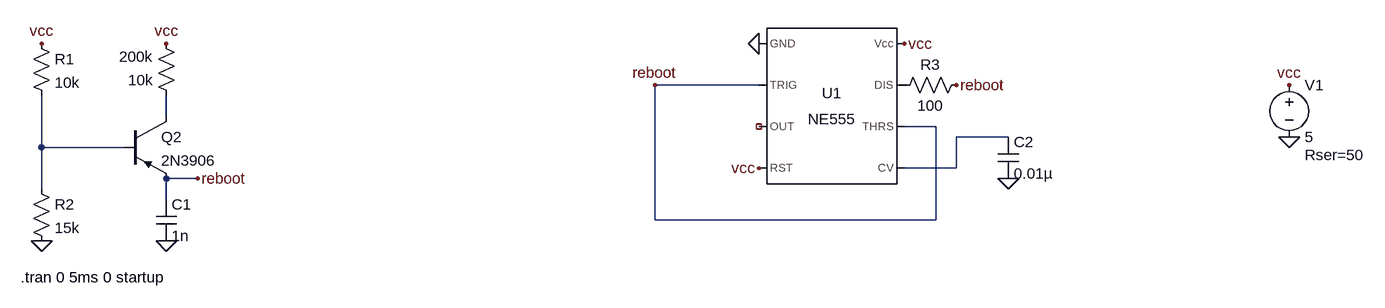
[diagram p0: schematic es la que va.asc]
es la que va.asc, the LTspice schematic file:
Version 4
SHEET 1 2016 680
WIRE 1072 0 912 0
WIRE 160 48 160 16
WIRE 1344 64 1296 64
WIRE 1456 80 1376 80
WIRE -32 96 -32 16
WIRE 96 96 -32 96
WIRE 1376 128 1376 80
WIRE 1376 128 1296 128
WIRE 208 144 160 144
WIRE -32 160 -32 96
WIRE 160 176 160 144
WIRE 912 208 912 0
WIRE 1344 208 1344 64
WIRE 1344 208 912 208
FLAG -32 -64 vcc
FLAG 160 -64 vcc
FLAG -32 240 0
FLAG 160 240 0
FLAG 1072 -64 0
FLAG 1296 -64 vcc
FLAG 208 144 reboot
FLAG 1072 128 vcc
FLAG 1456 144 0
FLAG 1888 80 0
FLAG 1888 0 vcc
FLAG 912 0 reboot
FLAG 1376 0 reboot
SYMBOL res -48 -80 R0
SYMATTR InstName R1
SYMATTR Value 10k
SYMBOL res -48 144 R0
SYMATTR InstName R2
SYMATTR Value 15k
SYMBOL res 176 32 R180
WINDOW 0 36 76 Left 2
WINDOW 3 36 40 Left 2
SYMATTR InstName 200k
SYMATTR Value 10k
SYMBOL cap 144 176 R0
SYMATTR InstName C1
SYMATTR Value 1n
SYMBOL pnp 96 48 R0
SYMATTR InstName Q2
SYMATTR Value 2N3906
SYMBOL Misc\\NE555 1184 32 R0
SYMATTR InstName U1
SYMBOL cap 1440 80 R0
SYMATTR InstName C2
SYMATTR Value 0.01µ
SYMBOL voltage 1888 -16 R0
WINDOW 123 0 0 Left 0
WINDOW 39 24 124 Left 2
SYMATTR SpiceLine Rser=50
SYMATTR InstName V1
SYMATTR Value 5
SYMBOL res 1392 -16 R90
WINDOW 0 0 56 VBottom 2
WINDOW 3 32 56 VTop 2
SYMATTR InstName R3
SYMATTR Value 100
TEXT -64 296 Left 2 !.tran 0 5ms 0 startup

The netlist it stands for:
* es la que va.asc
R1 vcc N003 10k
R2 N003 0 15k
R§200k N001 vcc 10k
C1 reboot 0 1n
Q2 N001 N003 reboot 0 2N3906
XU1 0 reboot NC_01 vcc N002 reboot P001 vcc NE555  ; pins GND TRIG OUT RST CV THRS DIS Vcc
C2 N002 0 0.01µ
V1 vcc 0 5 Rser=50
R3 reboot P001 100
.model NPN NPN
.model PNP PNP
.lib standard.bjt
.tran 0 5ms 0 startup
.lib NE555.sub
.backanno
.end